# EAGLE design PIC32BOARD_CN (EAGLE 5.12)
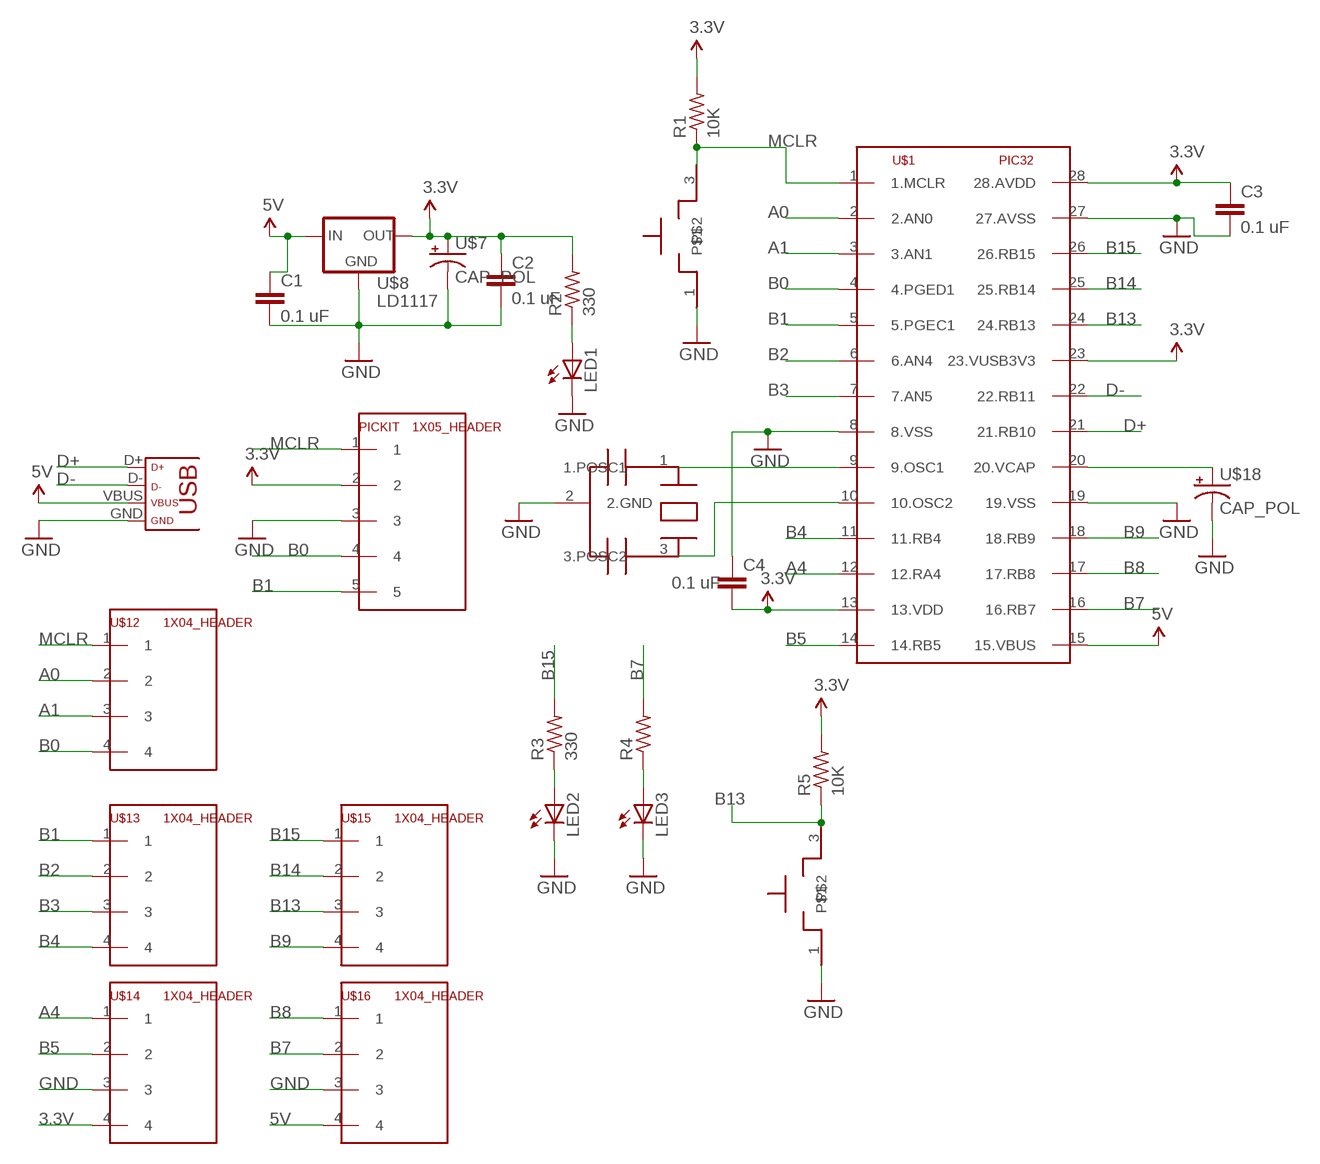
[diagram p0: schematic, sheet 1]

## Parts
C1  0.1 uF  C2,5-3  [C2.5-3]
C2  0.1 uF  C2,5-3  [C2.5-3]
C3  0.1 uF  C2,5-3  [C2.5-3]
C4  0.1 uF  C2,5-3  [C2.5-3]
LED1  LED3MM  [LED3MM]
LED2  LED3MM  [LED3MM]
LED3  LED3MM  [LED3MM]
PICKIT  1X05_HEADER  [1X05]
R1  10K  R-US_0309/12  [0309/12]
R2  330  R-US_0309/12  [0309/12]
R3  330  R-US_0309/12  [0309/12]
R4  R-US_0309/12  [0309/12]
R5  10K  R-US_0309/12  [0309/12]
U$1  PIC32  [DIL28-3]
U$2  BUTTON_CORRECT  [1X03]
U$4  BUTTON_CORRECT  [1X03]
U$6  8MHZ_OSC_V3  [UM1]
U$7  CAP_POL  [CAP_POL_D]
U$8  LD1117  [TO220]
U$9  USB  [USB-MINIB]
U$12  1X04_HEADER  [1X04]
U$13  1X04_HEADER  [1X04]
U$14  1X04_HEADER  [1X04]
U$15  1X04_HEADER  [1X04]
U$16  1X04_HEADER  [1X04]
U$18  CAP_POL  [CAP_POL_D]

## Nets
3.3V: C2.1 C3.1 C4.2 PICKIT.2 R1.2 R2.2 R5.2 U$1.13(13.VDD) U$1.23(23.VUSB3V3) U$1.28(28.AVDD) U$7.1(+) U$8.2(OUT) U$14.4
5V: C1.1 U$1.15(15.VBUS) U$8.3(IN) U$9.VBUS U$16.4
A0: U$1.2(2.AN0) U$12.2
A1: U$1.3(3.AN1) U$12.3
A4: U$1.12(12.RA4) U$14.1
B0: PICKIT.4 U$1.4(4.PGED1) U$12.4
B1: PICKIT.5 U$1.5(5.PGEC1) U$13.1
B2: U$1.6(6.AN4) U$13.2
B3: U$1.7(7.AN5) U$13.3
B4: U$1.11(11.RB4) U$13.4
B5: U$1.14(14.RB5) U$14.2
B7: R4.2 U$1.16(16.RB7) U$16.2
B8: U$1.17(17.RB8) U$16.1
B9: U$1.18(18.RB9) U$15.4
B13: R5.1 U$1.24(24.RB13) U$4.3 U$15.3
B14: U$1.25(25.RB14) U$15.2
B15: R3.2 U$1.26(26.RB15) U$15.1
D+: U$1.21(21.RB10) U$9.D+
D-: U$1.22(22.RB11) U$9.D-
GND: C1.2 C2.2 C3.2 C4.1 LED1.K(C) LED2.K(C) LED3.K(C) PICKIT.3 U$1.8(8.VSS) U$1.19(19.VSS) U$1.27(27.AVSS) U$2.1 U$4.1 U$6.2(2.GND) U$7.2(-) U$8.1(GND) U$9.GND U$14.3 U$16.3 U$18.2(-)
MCLR: PICKIT.1 R1.1 U$1.1(1.MCLR) U$2.3 U$12.1
N$1: U$1.20(20.VCAP) U$18.1(+)
N$6: U$1.9(9.OSC1) U$6.1(1.POSC1)
N$7: U$1.10(10.OSC2) U$6.3(3.POSC2)
N$9: LED2.A R3.1
N$10: LED3.A R4.1
N$12: LED1.A R2.1

## Library data of the parts
C1-C4 = ChrisNesler_PIC_board:C: CAPACITOR naming: grid - package width
LED1-LED3 = ChrisNesler_PIC_board:LED: LED OSRAM: - CHIPLED LG R971, LG N971, LY N971, LG Q971, LY Q971, LO R971, LY R971 LH N974, LH R974 LS Q976, LO Q976, LY Q976 LO Q996 - Hyper CHIPLED LW Q18S LB Q993, LB Q99A, LB R99A - SideLED LS A670, LO A670, LY A670, LG A670, LP A670 LB A673, LV A673, LT A673, LW A673 LH A674 LY A675 LS A676, LA A676, LO A676, LY A676, LW A676 LS A679, LY A679, LG A679 - Hyper Micro SIDELED® LS Y876, LA Y876, LO Y876, LY Y876 LT Y87S - SmartLED LW L88C, LW L88S LB L89C, LB L89S, LG L890 LS L89K, LO L89K, LY L89K LS L896, LA L896, LO L896, LY L896 - TOPLED LS T670, LO T670, LY T670, LG T670, LP T670 LSG T670, LSP T670, LSY T670, LOP T670, LYG T670 LG T671, LOG T671, LSG T671 LB T673, LV T673, LT T673, LW T673 LH T674 LS T676, LA T676, LO T676, LY T676, LB T676, LH T676, LSB T676, LW T676 LB T67C, LV T67C, LT T67C, LS T67K, LO T67K, LY T67K, LW E67C LS E67B, LA E67B, LO E67B, LY E67B, LB E67C, LV E67C, LT E67C LW T67C LS T679, LY T679, LG T679 LS T770, LO T770, LY T770, LG T770, LP T770 LB T773, LV T773, LT T773, LW T773 LH T774 LS E675, LA E675, LY E675, LS T675 LS T776, LA T776, LO T776, LY T776, LB T776 LHGB T686 LT T68C, LB T68C - Hyper Mini TOPLED® LB M676 - Mini TOPLED Santana® LG M470 LS M47K, LO M47K, LY M47K Source: http://www.osram.convergy.de LUXEON: - LUMILED® LXK2-PW12-R00, LXK2-PW12-S00, LXK2-PW14-U00, LXK2-PW14-V00 LXK2-PM12-R00, LXK2-PM12-S00, LXK2-PM14-U00 LXK2-PE12-Q00, LXK2-PE12-R00, LXK2-PE12-S00, LXK2-PE14-T00, LXK2-PE14-U00 LXK2-PB12-K00, LXK2-PB12-L00, LXK2-PB12-M00, LXK2-PB14-N00, LXK2-PB14-P00, LXK2-PB14-Q00 LXK2-PR12-L00, LXK2-PR12-M00, LXK2-PR14-Q00, LXK2-PR14-R00 LXK2-PD12-Q00, LXK2-PD12-R00, LXK2-PD12-S00 LXK2-PH12-R00, LXK2-PH12-S00 LXK2-PL12-P00, LXK2-PL12-Q00, LXK2-PL12-R00 Source: www.luxeon.com KINGBRIGHT: KA-3528ASYC Source: www.kingbright.com
PICKIT = ChrisNesler_PIC_board:1X05_HEADER
R1-R5 = ChrisNesler_PIC_board:R-US_: RESISTOR, American symbol
U$1 = ChrisNesler_PIC_board:PIC32
U$2 U$4 = ChrisNesler_PIC_board:BUTTON_CORRECT
U$6 = ChrisNesler_PIC_board:8MHZ_OSC_V3
U$7 U$18 = ChrisNesler_PIC_board:CAP_POL
U$8 = ChrisNesler_PIC_board:LD1117
U$9 = ChrisNesler_PIC_board:USB
U$12-U$16 = ChrisNesler_PIC_board:1X04_HEADER

## Board
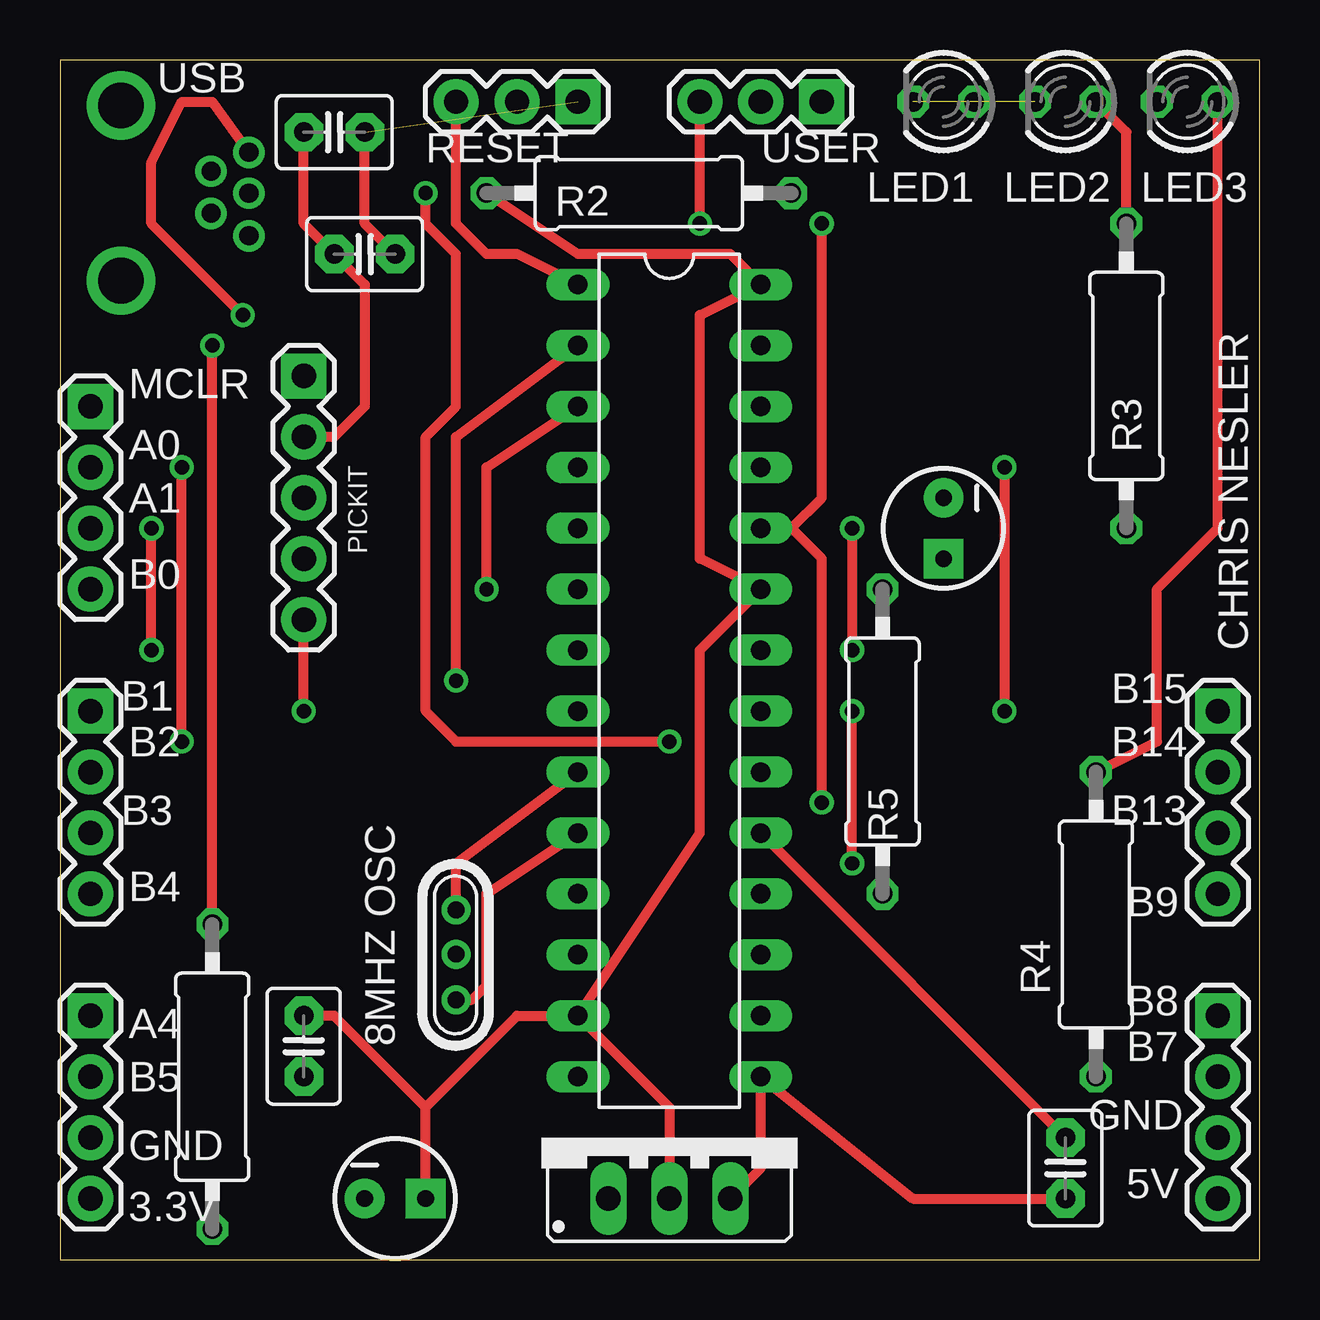
[diagram p1: board, top side]
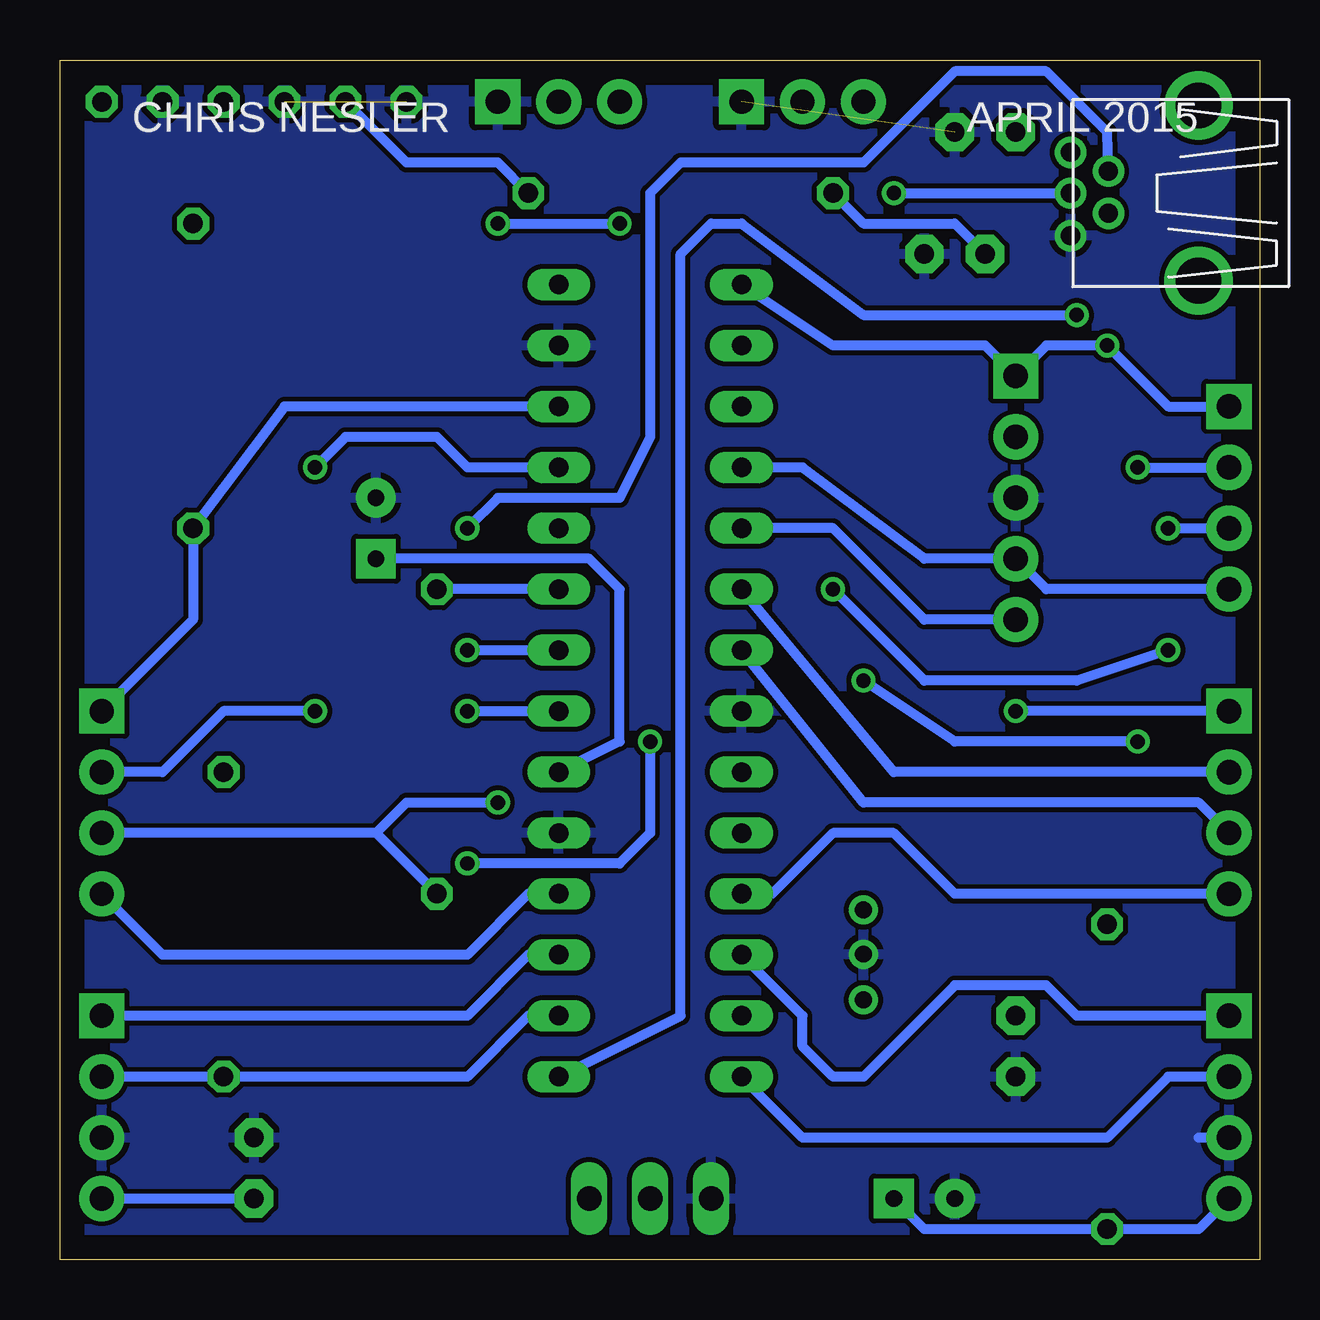
[diagram p2: board, bottom side, seen from below]

Size 50 x 50 mm. Coordinates in mm from the lower left corner, seen from the top.
Outline: 0,0 50,0 50,50 0,50 0,0
Copper layers (1*16): Top 0.035mm / dielectric 1.5mm / Bottom 0.035mm
Design rules "default": minimum track width 10mil, minimum drill 24mil, track to track 8mil, track to pad 8mil, pad to pad 8mil, via to via 8mil, smd to smd 8mil, copper to edge 40mil, drill to drill 8mil, minimum pad ring 10mil, minimum via ring 8mil, stop-mask expansion 4mil, vias tented up to drill 0mil, thermal gap 10mil

### Footprints (pad centres in the part's own frame; a part is rotated, then mirrored left to right if it is on the bottom)
C2.5-3 = drill 0.813 pad 1.6 octagon: 1 -1.27,0; 2 1.27,0
LED3MM = drill 0.813 octagon: A -1.27,0; K 1.27,0
1X05 = drill 1.016 pad 1.88 square: 1 0,0 | drill 1.016 pad 1.88 round: 2 2.54,0; 3 5.08,0; 4 7.62,0; 5 10.16,0
0309/12 = drill 0.813 octagon: 1 -6.35,0; 2 6.35,0
DIL28-3 = drill 0.813 long: 1 -16.51,-3.81; 2 -13.97,-3.81; 3 -11.43,-3.81; 4 -8.89,-3.81; 5 -6.35,-3.81; 6 -3.81,-3.81; 7 -1.27,-3.81; 8 1.27,-3.81; 9 3.81,-3.81; 10 6.35,-3.81; 11 8.89,-3.81; 12 11.43,-3.81; 13 13.97,-3.81; 14 16.51,-3.81; 15 16.51,3.81; 16 13.97,3.81; 17 11.43,3.81; 18 8.89,3.81; 19 6.35,3.81; 20 3.81,3.81; 21 1.27,3.81; 22 -1.27,3.81; 23 -3.81,3.81; 24 -6.35,3.81; 25 -8.89,3.81; 26 -11.43,3.81; 27 -13.97,3.81; 28 -16.51,3.81
1X03 = drill 1.016 pad 1.88 square: 1 0,0 | drill 1.016 pad 1.88 round: 2 2.54,0; 3 5.08,0
UM1 = drill 0.7 pad 1.2 round: 1 -1.875,0; 2 -0.027,0; 3 1.875,0
CAP_POL_D = drill 0.7 pad 1.651 square: 1 1.27,0 | drill 0.7 pad 1.651 round: 2 -1.27,0
TO220 = drill 1.016 long: 1 -2.54,0; 2 0,0; 3 2.54,0
USB-MINIB = drill 0.8 round: D+ 4.064,0; D- 2.489,0.914; GND 4.064,-1.778; ID 2.489,-0.838; VBUS 4.064,1.702 | drill 1.9 round: P$6 -1.27,-3.65; P$7 -1.27,3.65
1X04 = drill 1.016 pad 1.88 square: 1 0,0 | drill 1.016 pad 1.88 round: 2 2.54,0; 3 5.08,0; 4 7.62,0

### Placement (x,y rotation side)
C1  41.91,3.81 90 top
C2  11.43,46.99 0 top
C3  12.7,41.91 0 top
C4  10.16,8.89 90 top
LED1  36.83,48.26 180 top
LED2  41.91,48.26 180 top
LED3  46.99,48.26 180 top
PICKIT  10.16,36.83 270 top
R1  6.35,7.62 270 top
R2  24.13,44.45 180 top
R3  44.45,36.83 270 top
R4  43.18,13.97 270 top
R5  34.29,21.59 90 top
U$1  25.4,24.13 270 top
U$2  21.59,48.26 180 top
U$4  31.75,48.26 180 top
U$6  16.51,12.7 270 top
U$7  13.97,2.54 0 top
U$8  25.4,2.54 0 top
U$9  3.81,44.45 0 top
U$12  1.27,35.56 270 top
U$13  1.27,22.86 270 top
U$14  1.27,10.16 270 top
U$15  48.26,22.86 270 top
U$16  48.26,10.16 270 top
U$18  36.83,30.48 270 top

### Tracks (layer width: path | path; a pad name or v marks a point on that pad's centre or on a via)
3.3V
  Top 0.406: C2.1 10.16,43.18 C3.1 12.7,40.64 12.7,35.56 11.43,34.29 PICKIT.2 | U$7.1 15.24,6.35 | 15.24,6.35 19.05,10.16 U$1.13 | U$1.13 26.67,17.78 26.67,25.4 U$1.23 26.67,29.21 26.67,39.37 U$1.28 27.94,41.91 21.59,41.91 R2.2 | U$1.13 25.4,6.35 U$8.2 | C4.2 11.43,10.16 15.24,6.35
  Bottom 0.406: U$14.4 2.54,1.27 R1.2 13.97,1.27 U$7.1 | C3.1 12.7,43.18 16.51,43.18 R2.2 | U$1.23 R5.2
5V  (via drill 0.6)
  Top 0.406: C1.1 35.56,2.54 U$1.15 29.21,3.81 U$8.3 | U$9.VBUS 6.35,48.26 5.08,48.26 3.81,45.72 3.81,43.18 v7.62,39.37
  Bottom 0.406: C1.1 U$16.4 | v7.62,39.37 16.51,39.37 21.59,43.18 22.86,43.18 24.13,41.91 24.13,10.16 U$1.15
A0  (via drill 0.6)
  Top 0.406: v5.08,21.59 v5.08,33.02 | v16.51,24.13 16.51,34.29 U$1.2
  Bottom 0.406: v5.08,33.02 U$12.2 | v5.08,21.59 12.7,21.59 v16.51,24.13
A1  (via drill 0.6)
  Top 0.406: v3.81,25.4 v3.81,30.48 | v17.78,27.94 17.78,33.02 U$1.3
  Bottom 0.406: v3.81,30.48 U$12.3 | v3.81,25.4 7.62,24.13 13.97,24.13 v17.78,27.94
A4
  Bottom 0.406: U$14.1 7.62,10.16 8.89,11.43 12.7,11.43 16.51,7.62 17.78,7.62 19.05,8.89 19.05,10.16 U$1.12
B0
  Bottom 0.406: U$12.4 8.89,27.94 PICKIT.4 13.97,29.21 19.05,33.02 U$1.4
B1  (via drill 0.6)
  Top 0.406: v10.16,22.86 PICKIT.5
  Bottom 0.406: U$13.1 v10.16,22.86 | PICKIT.5 13.97,26.67 17.78,30.48 U$1.5
B2
  Bottom 0.406: U$13.2 15.24,20.32 U$1.6
B3
  Bottom 0.406: U$1.7 16.51,19.05 2.54,19.05 U$13.3
B4
  Bottom 0.406: U$13.4 12.7,15.24 15.24,17.78 17.78,17.78 20.32,15.24 U$1.11
B5
  Bottom 0.406: U$14.2 3.81,7.62 6.35,5.08 19.05,5.08 U$1.14
B7
  Bottom 0.406: U$16.2 R4.2 33.02,7.62 30.48,10.16 U$1.16
B8
  Bottom 0.406: U$1.17 30.48,12.7 33.02,10.16 U$16.1
B9
  Bottom 0.406: U$1.18 30.48,15.24 33.02,12.7 45.72,12.7 U$15.4
B13  (via drill 0.6)
  Top 0.406: v26.67,43.18 U$4.3 | v31.75,43.18 31.75,31.75 30.48,30.48 | 30.48,30.48 U$1.24 | 30.48,30.48 31.75,29.21 v31.75,19.05
  Bottom 0.406: R5.1 36.83,17.78 | 36.83,17.78 U$15.3 | v31.75,43.18 v26.67,43.18 | v31.75,19.05 35.56,19.05 36.83,17.78
B14  (via drill 0.6)
  Top 0.406: v39.37,33.02 v39.37,22.86
  Bottom 0.406: U$15.2 45.72,20.32 43.18,22.86 v39.37,22.86 | U$1.25 33.02,33.02 34.29,34.29 38.1,34.29 v39.37,33.02
B15
  Bottom 0.406: U$15.1 44.45,26.67 R3.2 40.64,35.56 U$1.26
D+  (via drill 0.6)
  Top 0.406: v15.24,44.45 15.24,43.18 16.51,41.91 16.51,35.56 15.24,34.29 15.24,22.86 16.51,21.59 v25.4,21.59 | v33.02,16.51 v33.02,22.86
  Bottom 0.406: v15.24,44.45 U$9.D+ | v25.4,21.59 25.4,17.78 26.67,16.51 v33.02,16.51 | v33.02,22.86 U$1.21
D-  (via drill 0.6)
  Top 0.406: v33.02,30.48 v33.02,25.4
  Bottom 0.406: U$9.D- 6.35,46.99 8.89,49.53 12.7,49.53 16.51,45.72 24.13,45.72 25.4,44.45 25.4,34.29 26.67,31.75 31.75,31.75 v33.02,30.48 | v33.02,25.4 U$1.22
GND  (2 unrouted)
  Top 0.406: C2.2 12.7,43.18 C3.2 | C1.2 U$1.19
  Bottom 0.406: U$14.3 2.54,5.08
  pour Bottom: 0,0 0,49.53 49.53,49.53 49.53,0
MCLR  (via drill 0.6)
  Top 0.406: R1.1 v6.35,38.1 | U$1.1 19.05,41.91 17.78,41.91 16.51,43.18 U$2.3
  Bottom 0.406: U$12.1 3.81,35.56 v6.35,38.1 8.89,38.1 PICKIT.1 11.43,38.1 17.78,38.1 U$1.1
N$1
  Bottom 0.406: U$18.1 27.94,29.21 26.67,27.94 26.67,21.59 U$1.20
N$6
  Top 0.406: U$6.1 16.51,16.51 U$1.9
N$7
  Top 0.406: U$6.3 17.18,10.82 17.78,11.43 17.78,15.24 U$1.10
N$9
  Top 0.406: LED2.A 44.45,46.99 R3.1
N$10
  Top 0.406: R4.1 45.72,21.59 45.72,27.94 48.26,30.48 LED3.A
N$12
  Bottom 0.406: R2.1 31.75,45.72 35.56,45.72 LED1.A

### Text on the board
tPlace: RESET | USER | MCLR | A0 | A1 | B0 | CHRIS NESLER | B1 | B15 | B2 | B14 | B3 | B13 | B4 | B9 | B8 | A4 | 8MHZ OSC | B7 | B5 | GND | GND | 5V | 3.3V
bPlace: APRIL 2015 | CHRIS NESLER